# Altium schematic sheet Sheet1.SchDoc
size B
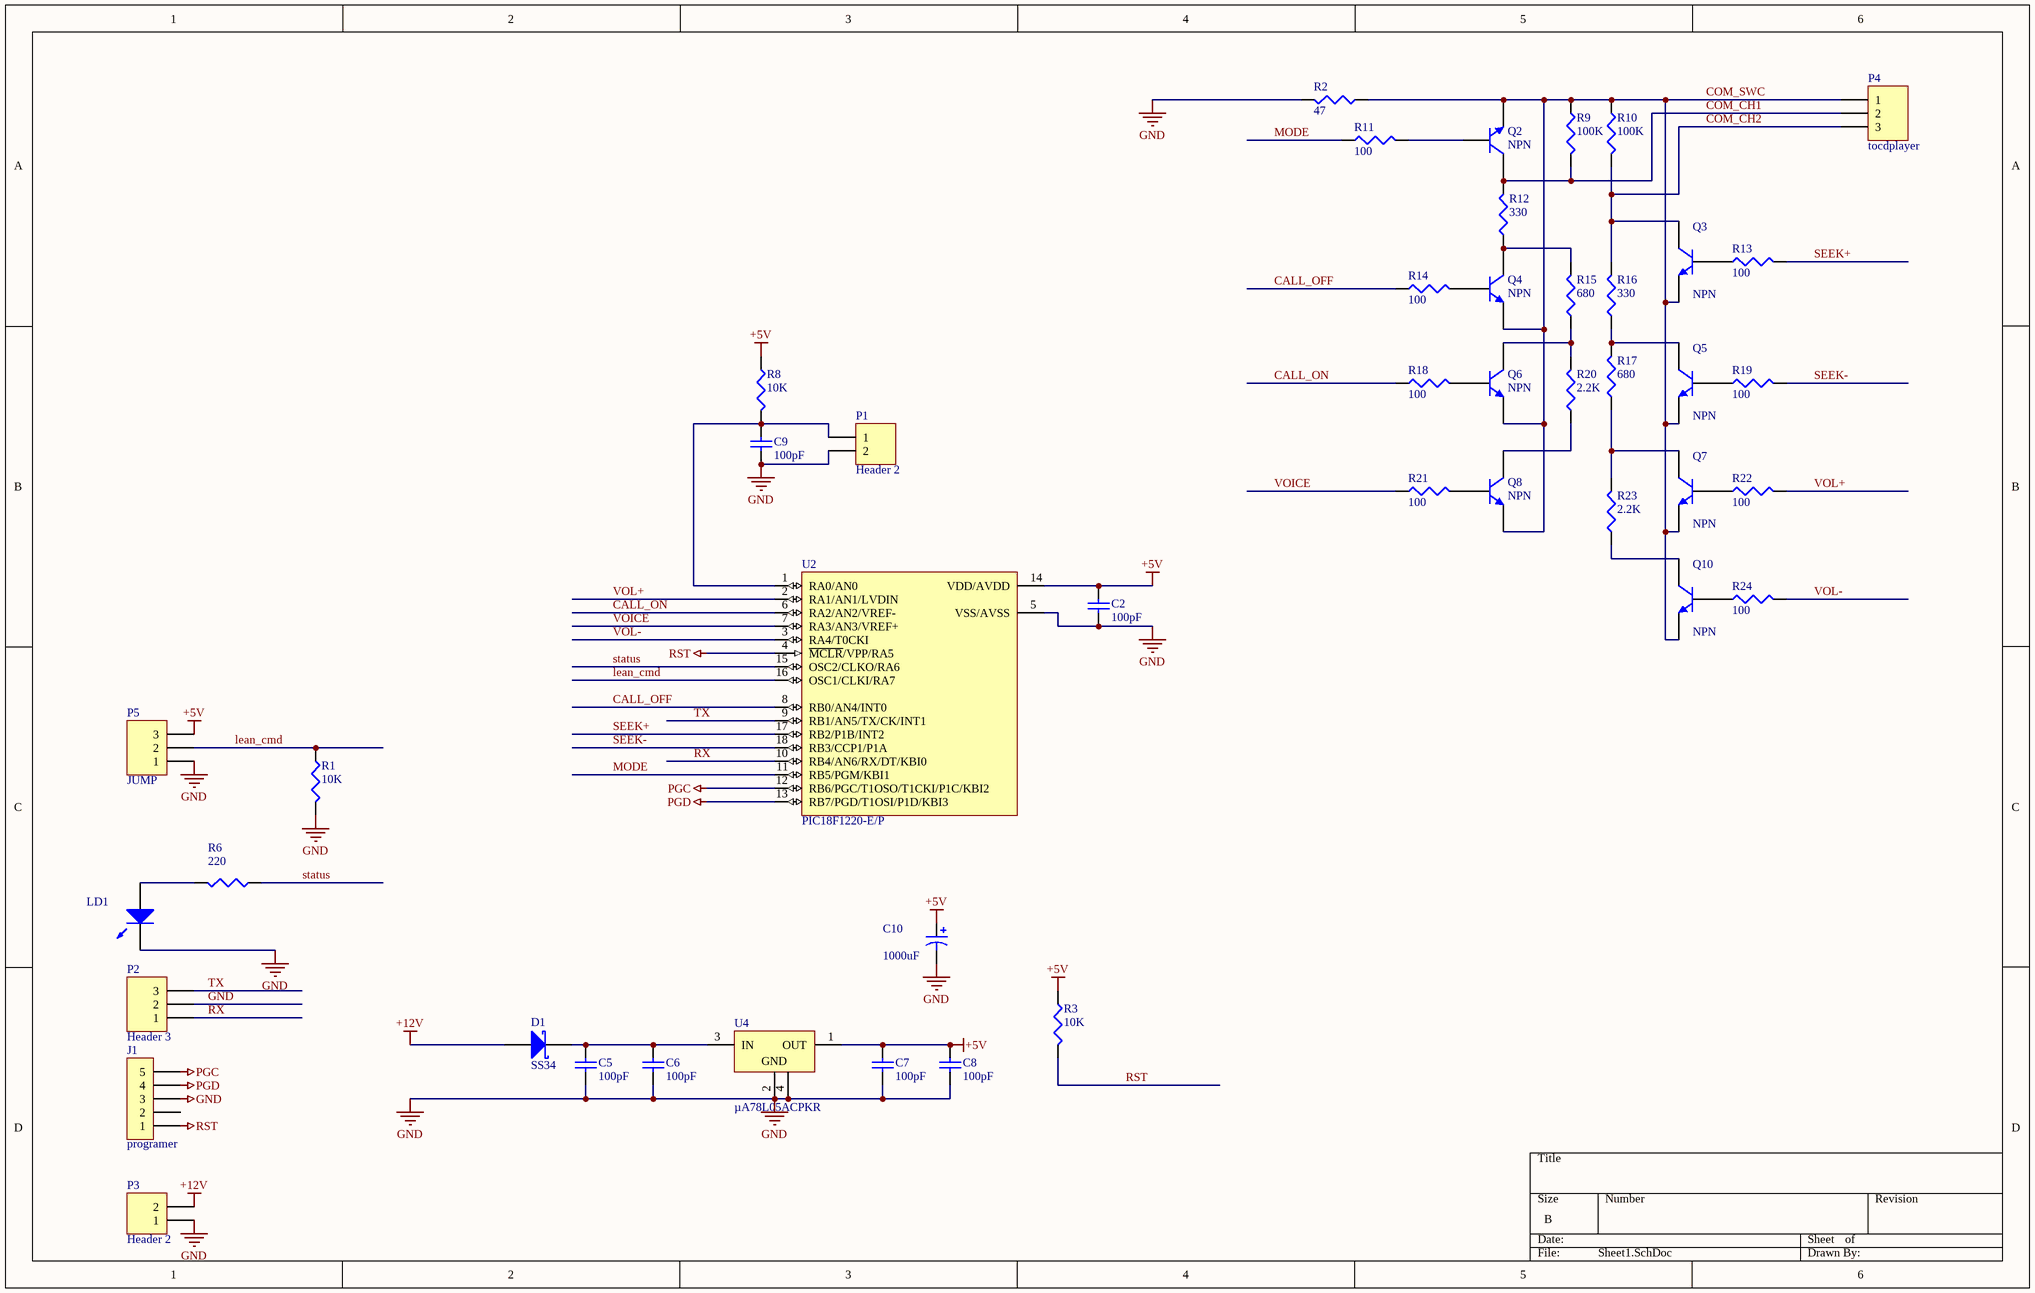
[diagram p0: Sheet1.SchDoc]

## Parts
C2  value 100pF  [RESC2012L]  (hidden comment: Cap Semi)
C5  value 100pF  [RESC2012L]  (hidden comment: Cap Semi)
C6  value 100pF  [RESC2012L]  (hidden comment: Cap Semi)
C7  value 100pF  [RESC2012L]  (hidden comment: Cap Semi)
C8  value 100pF  [RESC2012L]  (hidden comment: Cap Semi)
C9  value 100pF  [RESC2012L]  (hidden comment: Cap Semi)
C10  value 1000uF  [CAP8x8]  (hidden comment: EEE-FT1A102AP)
D1  SS34  [SMB]
J1  programer  [HDR1x5]
LD1  LNJ911W8BRU  [CD3216-1206]  (value not drawn)
P1  Header 2  [CON_PLUG2]
P2  Header 3  [HDR1X3]
P3  Header 2  [HDR1X2]
P4  tocdplayer  [HDR1X3]
P5  JUMP  [HDR1X3]
Q2  NPN  [SOT-23B]
Q3  NPN  [SOT-23B]
Q4  NPN  [SOT-23B]
Q5  NPN  [SOT-23B]
Q6  NPN  [SOT-23B]
Q7  NPN  [SOT-23B]
Q8  NPN  [SOT-23B]
Q10  NPN  [SOT-23B]
R1  value 10K  [RESC2012L]  (hidden comment: Res3)
R2  value 47  [RESC2012L]  (hidden comment: Res3)
R3  value 10K  [RESC2012L]  (hidden comment: Res3)
R6  value 220  [RESC2012L]  (hidden comment: Res3)
R8  value 10K  [RESC2012L]  (hidden comment: Res3)
R9  value 100K  [RESC2012L]  (hidden comment: Res3)
R10  value 100K  [RESC2012L]  (hidden comment: Res3)
R11  value 100  [RESC2012L]  (hidden comment: Res3)
R12  value 330  [RESC2012L]  (hidden comment: Res3)
R13  value 100  [RESC2012L]  (hidden comment: Res3)
R14  value 100  [RESC2012L]  (hidden comment: Res3)
R15  value 680  [RESC2012L]  (hidden comment: Res3)
R16  value 330  [RESC2012L]  (hidden comment: Res3)
R17  value 680  [RESC2012L]  (hidden comment: Res3)
R18  value 100  [RESC2012L]  (hidden comment: Res3)
R19  value 100  [RESC2012L]  (hidden comment: Res3)
R20  value 2.2K  [RESC2012L]  (hidden comment: Res3)
R21  value 100  [RESC2012L]  (hidden comment: Res3)
R22  value 100  [RESC2012L]  (hidden comment: Res3)
R23  value 2.2K  [RESC2012L]  (hidden comment: Res3)
R24  value 100  [RESC2012L]  (hidden comment: Res3)
U2  PIC18F1220-E/P  [PDIP300-P18]
U4  µA78L05ACPKR  [PK03]

## Nets
+5V: C2.2 C7.2 C8.2 C10.1 P5.3 R3.1 R8.1 U2.14(VDD/AVDD) U4.1(OUT)
+12V: D1.1(A) P3.2
GND: C2.1 C5.1 C6.1 C7.1 C8.1 C9.1 C10.2 J1.3 LD1.2(K) P1.2 P2.2 P3.1 P5.1 R1.2 R2.2 U2.5(VSS/AVSS) U4.2(GND) U4.4(GND)
PGC: J1.5 U2.12(RB6/PGC/T1OSO/T1CKI/P1C/KBI2)
PGD: J1.4 U2.13(RB7/PGD/T1OSI/P1D/KBI3)
RST: J1.1 R3.2 U2.4(~{MCLR}/VPP/RA5)
CALL_OFF: R14.1 U2.8(RB0/AN4/INT0)
CALL_ON: R18.1 U2.6(RA2/AN2/VREF-)
COM_CH1: P4.2 Q2.1(C) R9.2 R12.2
COM_CH2: P4.3 Q3.1(C) R10.2 R16.2
COM_SWC: P4.1 Q2.3(E) Q3.3(E) Q4.3(E) Q5.3(E) Q6.3(E) Q7.3(E) Q8.3(E) Q10.3(E) R2.1 R9.1 R10.1
lean_cmd: P5.2 R1.1 U2.16(OSC1/CLKI/RA7)
MODE: R11.1 U2.11(RB5/PGM/KBI1)
RX: P2.1 U2.10(RB4/AN6/RX/DT/KBI0)
SEEK+: R13.2 U2.17(RB2/P1B/INT2)
SEEK-: R19.2 U2.18(RB3/CCP1/P1A)
status: R6.1 U2.15(OSC2/CLKO/RA6)
TX: P2.3 U2.9(RB1/AN5/TX/CK/INT1)
VOICE: R21.1 U2.7(RA3/AN3/VREF+)
VOL+: R22.2 U2.2(RA1/AN1/LVDIN)
VOL-: R24.2 U2.3(RA4/T0CKI)
NetC5_2: C5.2 C6.2 D1.2(K) U4.3(IN)
NetC9_2: C9.2 P1.1 R8.2 U2.1(RA0/AN0)
NetLD1_1: LD1.1(A) R6.2
NetQ2_2: Q2.2(B) R11.2
NetQ3_2: Q3.2(B) R13.1
NetQ4_1: Q4.1(C) R12.1 R15.2
NetQ4_2: Q4.2(B) R14.2
NetQ5_1: Q5.1(C) R16.1 R17.2
NetQ5_2: Q5.2(B) R19.1
NetQ6_1: Q6.1(C) R15.1 R20.2
NetQ6_2: Q6.2(B) R18.2
NetQ7_1: Q7.1(C) R17.1 R23.2
NetQ7_2: Q7.2(B) R22.1
NetQ8_1: Q8.1(C) R20.1
NetQ8_2: Q8.2(B) R21.2
NetQ10_1: Q10.1(C) R23.1
NetQ10_2: Q10.2(B) R24.1

Not connected (* = marked no-connect by the designer): J1 2

## Library data of the parts
C2 C5-C9 = Cap Semi: Capacitor (Semiconductor SIM Model); Published: 8-Jun-2000; LatestRevisionDate: 29-May-2009; LatestRevisionNote: IPC-7351 Footprint Added.; PackageReference: C1206; Publisher: Altium Limited; PackageDescription: Chip Capacitor
C10 = Cap Pol1: CAP ALUM 1000UF 10V 20% SMD; Published: 8-Jun-2000; LatestRevisionDate: 17-Jul-2002; LatestRevisionNote: Re-released for DXP Platform.; PackageReference: RB7.6-15; Publisher: Altium Limited; PackageDescription: Polarized Capacitor (Radial); 2 Leads
D1 = D Schottky SS34: DIODE SCHOTTKY 40V 3A SMC; Published: 8-Jun-2000; LatestRevisionDate: 17-Jul-2002; LatestRevisionNote: Re-released for DXP Platform.; PackageReference: SMB; Publisher: Altium Limited; PackageDescription: DO-214-AA/SMB; 2 C-Bend Leads; Body 5.3 x 3.6 mm, inc. leads (LxW); Code_JEDEC: DO-214-AA
J1 = CON5: Connector
LD1 = LEDRED1206: LED BLUE THRU BOARD 1206; VENDOR P/N: LH N974-KN-1; VENDOR: OSRAM Opto Semiconductors Inc; Indicate: 12V; GGC VENDOR: OSRAM Opto Semiconductors Inc; GCC P/N: LH N974-KN-1; DIGIKEY P/N: P0.0JCT-ND; DIGIKEY MOQ1: 0.11
P1 P3 = Header 2: Header, 2-Pin; LatestRevisionDate: 17-Jul-2002; LatestRevisionNote: Re-released for DXP Platform.; Publisher: Altium Limited
P2 P4 P5 = Header 3: Header, 3-Pin; LatestRevisionDate: 17-Jul-2002; LatestRevisionNote: Re-released for DXP Platform.; Publisher: Altium Limited
Q2-Q8 Q10 = NPN: NPN Bipolar Transistor; Published: 8-Jun-2000; LatestRevisionDate: 17-Jul-2002; LatestRevisionNote: Re-released for DXP Platform.; PackageReference: TO-226-AA; Publisher: Altium Limited; PackageDescription: TO, Flat Index; 3 In-Line, Axial Leads; Body Dia. 4.8mm; Leads 0.55 x 0.51 mm (max); Code_JEDEC: TO-226-AA
R1-R3 R6 R8-R24 = Res3: Resistor; Published: 8-Jun-2000; LatestRevisionDate: 29-May-2009; LatestRevisionNote: IPC-7351 Footprint Added.; PackageReference: J1-0603; Publisher: Altium Limited; PackageDescription: Chip Resistor
U2 = PIC18F1220-E/P: High Performance, Enhanced Flash Microcontroller with 10-Bit A/D and nanoWatt Technology, 4K Flash, 18-Pin PDIP, Extended Temperature; Published: 11-Oct-2004; LatestRevisionDate: 29-Jan-2009; LatestRevisionNote: Sch. layout revised. 3D Model Removed.; DatasheetVersion: revF, Feb-2007; PackageVersion: revBB, Aug-2009; PackageReference: PDIP300-P18; Publisher: Altium Limited; PackageDescription: 18-Lead Plastic Dual In-Line (P) - 300 mil Body [PDIP]; Supplier 1: Digi-Key; Supplier Part Number 1: PIC18F1220-E/P-ND; Supplier 2: Farnell; Supplier Part Number 2: 1579595; Code_JEDEC: MS-001; ComponentLink1Description: Datasheet; ComponentLink1URL: http://ww1.microchip.com/downloads/en/DeviceDoc/39605F.pdf; ComponentLink2Description: Packaging Specification; ComponentLink2URL: http://www.microchip.com/stellent/groups/techpub_sg/documents/packagingspec/en012702.pdf; ComponentLink3Description: Microchip.com Home; ComponentLink3URL: http://www.microchip.com/
U4 = µA78L05ACPKR: Positive-Voltage Regulator; Note: Pin 2 is electrically connected to TAB.; Published: 15-Apr-2002; DatasheetVersion: Jul-2000; PackageVersion: Oct-1994; PackageReference: PK03; Publisher: Altium Limited; PackageDescription: SOT-89; Body 4.6 x 4.25 mm, inc. leads (LxW max); Code_JEDEC: TO-243-AA; Code_IPC: SOT 89; ComponentLink1Description: Manufacturer Link; ComponentLink1URL: http://www.ti.com/; ComponentLink2Description: Datasheet; ComponentLink2URL: http://www-s.ti.com/sc/ds/ua78l05a.pdf